# EAGLE schematic led_matrix_v_1_0 (EAGLE 7.3.0)
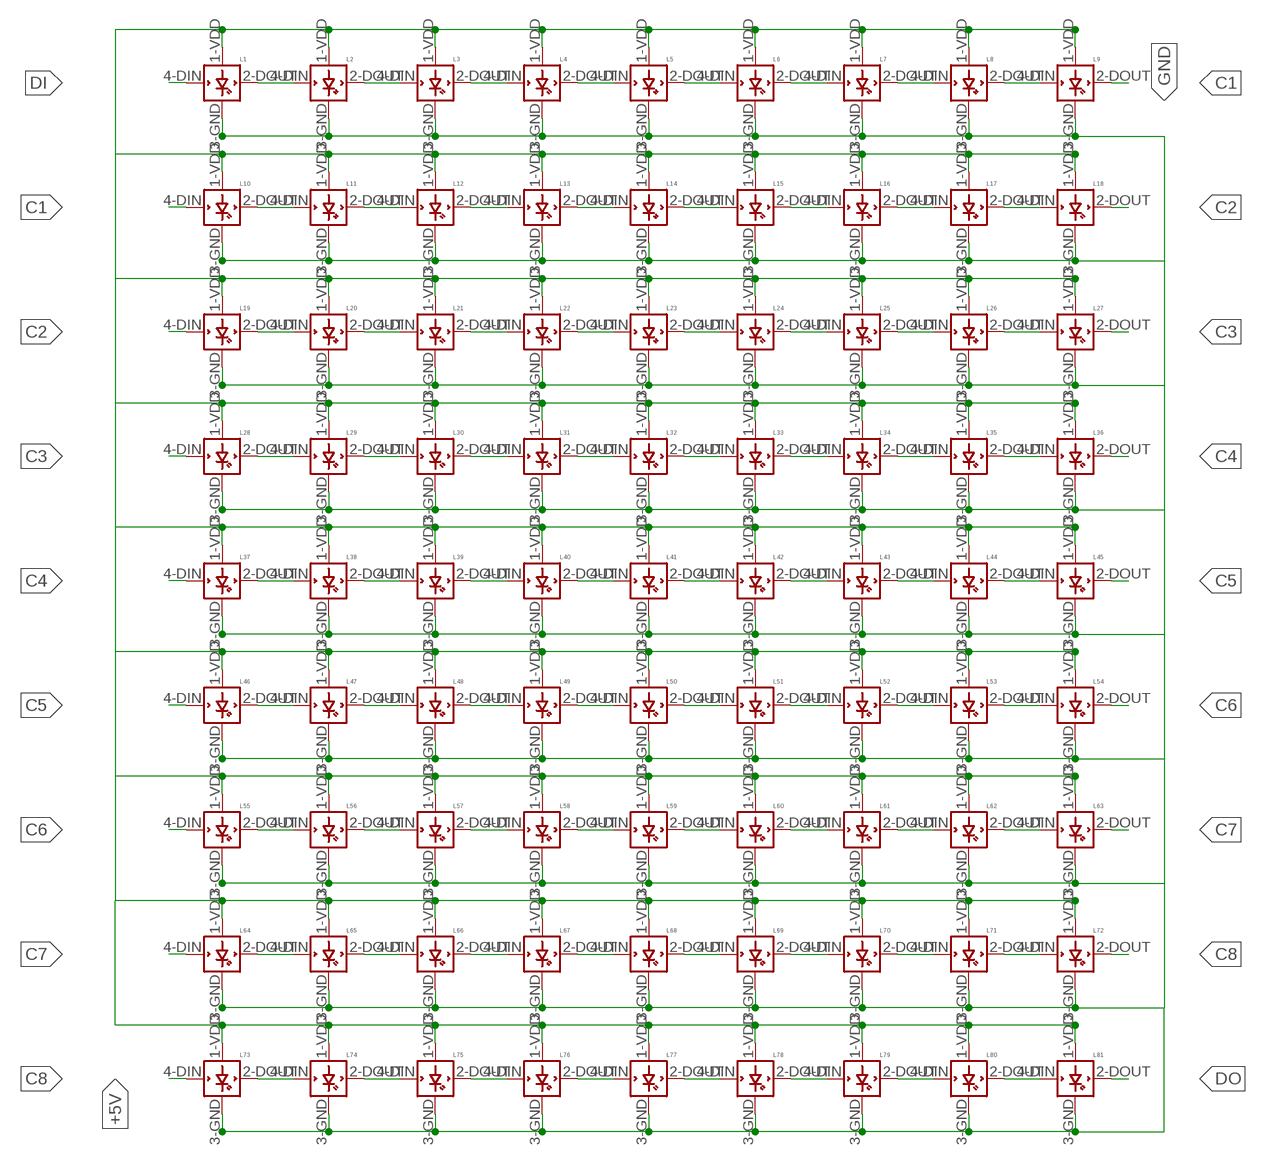
[diagram p0: schematic, sheet 1]

## Parts
L1  WS2812B  [WS2812B]
L2  WS2812B  [WS2812B]
L3  WS2812B  [WS2812B]
L4  WS2812B  [WS2812B]
L5  WS2812B  [WS2812B]
L6  WS2812B  [WS2812B]
L7  WS2812B  [WS2812B]
L8  WS2812B  [WS2812B]
L9  WS2812B  [WS2812B]
L10  WS2812B  [WS2812B]
L11  WS2812B  [WS2812B]
L12  WS2812B  [WS2812B]
L13  WS2812B  [WS2812B]
L14  WS2812B  [WS2812B]
L15  WS2812B  [WS2812B]
L16  WS2812B  [WS2812B]
L17  WS2812B  [WS2812B]
L18  WS2812B  [WS2812B]
L19  WS2812B  [WS2812B]
L20  WS2812B  [WS2812B]
L21  WS2812B  [WS2812B]
L22  WS2812B  [WS2812B]
L23  WS2812B  [WS2812B]
L24  WS2812B  [WS2812B]
L25  WS2812B  [WS2812B]
L26  WS2812B  [WS2812B]
L27  WS2812B  [WS2812B]
L28  WS2812B  [WS2812B]
L29  WS2812B  [WS2812B]
L30  WS2812B  [WS2812B]
L31  WS2812B  [WS2812B]
L32  WS2812B  [WS2812B]
L33  WS2812B  [WS2812B]
L34  WS2812B  [WS2812B]
L35  WS2812B  [WS2812B]
L36  WS2812B  [WS2812B]
L37  WS2812B  [WS2812B]
L38  WS2812B  [WS2812B]
L39  WS2812B  [WS2812B]
L40  WS2812B  [WS2812B]
L41  WS2812B  [WS2812B]
L42  WS2812B  [WS2812B]
L43  WS2812B  [WS2812B]
L44  WS2812B  [WS2812B]
L45  WS2812B  [WS2812B]
L46  WS2812B  [WS2812B]
L47  WS2812B  [WS2812B]
L48  WS2812B  [WS2812B]
L49  WS2812B  [WS2812B]
L50  WS2812B  [WS2812B]
L51  WS2812B  [WS2812B]
L52  WS2812B  [WS2812B]
L53  WS2812B  [WS2812B]
L54  WS2812B  [WS2812B]
L55  WS2812B  [WS2812B]
L56  WS2812B  [WS2812B]
L57  WS2812B  [WS2812B]
L58  WS2812B  [WS2812B]
L59  WS2812B  [WS2812B]
L60  WS2812B  [WS2812B]
L61  WS2812B  [WS2812B]
L62  WS2812B  [WS2812B]
L63  WS2812B  [WS2812B]
L64  WS2812B  [WS2812B]
L65  WS2812B  [WS2812B]
L66  WS2812B  [WS2812B]
L67  WS2812B  [WS2812B]
L68  WS2812B  [WS2812B]
L69  WS2812B  [WS2812B]
L70  WS2812B  [WS2812B]
L71  WS2812B  [WS2812B]
L72  WS2812B  [WS2812B]
L73  WS2812B  [WS2812B]
L74  WS2812B  [WS2812B]
L75  WS2812B  [WS2812B]
L76  WS2812B  [WS2812B]
L77  WS2812B  [WS2812B]
L78  WS2812B  [WS2812B]
L79  WS2812B  [WS2812B]
L80  WS2812B  [WS2812B]
L81  WS2812B  [WS2812B]

## Nets
+5V: L1.1-VDD(VDD) L2.1-VDD(VDD) L3.1-VDD(VDD) L4.1-VDD(VDD) L5.1-VDD(VDD) L6.1-VDD(VDD) L7.1-VDD(VDD) L8.1-VDD(VDD) L9.1-VDD(VDD) L10.1-VDD(VDD) L11.1-VDD(VDD) L12.1-VDD(VDD) L13.1-VDD(VDD) L14.1-VDD(VDD) L15.1-VDD(VDD) L16.1-VDD(VDD) L17.1-VDD(VDD) L18.1-VDD(VDD) L19.1-VDD(VDD) L20.1-VDD(VDD) L21.1-VDD(VDD) L22.1-VDD(VDD) L23.1-VDD(VDD) L24.1-VDD(VDD) L25.1-VDD(VDD) L26.1-VDD(VDD) L27.1-VDD(VDD) L28.1-VDD(VDD) L29.1-VDD(VDD) L30.1-VDD(VDD) L31.1-VDD(VDD) L32.1-VDD(VDD) L33.1-VDD(VDD) L34.1-VDD(VDD) L35.1-VDD(VDD) L36.1-VDD(VDD) L37.1-VDD(VDD) L38.1-VDD(VDD) L39.1-VDD(VDD) L40.1-VDD(VDD) L41.1-VDD(VDD) L42.1-VDD(VDD) L43.1-VDD(VDD) L44.1-VDD(VDD) L45.1-VDD(VDD) L46.1-VDD(VDD) L47.1-VDD(VDD) L48.1-VDD(VDD) L49.1-VDD(VDD) L50.1-VDD(VDD) L51.1-VDD(VDD) L52.1-VDD(VDD) L53.1-VDD(VDD) L54.1-VDD(VDD) L55.1-VDD(VDD) L56.1-VDD(VDD) L57.1-VDD(VDD) L58.1-VDD(VDD) L59.1-VDD(VDD) L60.1-VDD(VDD) L61.1-VDD(VDD) L62.1-VDD(VDD) L63.1-VDD(VDD) L64.1-VDD(VDD) L65.1-VDD(VDD) L66.1-VDD(VDD) L67.1-VDD(VDD) L68.1-VDD(VDD) L69.1-VDD(VDD) L70.1-VDD(VDD) L71.1-VDD(VDD) L72.1-VDD(VDD) L73.1-VDD(VDD) L74.1-VDD(VDD) L75.1-VDD(VDD) L76.1-VDD(VDD) L77.1-VDD(VDD) L78.1-VDD(VDD) L79.1-VDD(VDD) L80.1-VDD(VDD) L81.1-VDD(VDD)
C1: L9.2-DOUT(DOUT) L10.4-DIN(DIN)
C2: L18.2-DOUT(DOUT) L19.4-DIN(DIN)
C3: L27.2-DOUT(DOUT) L28.4-DIN(DIN)
C4: L36.2-DOUT(DOUT) L37.4-DIN(DIN)
C5: L45.2-DOUT(DOUT) L46.4-DIN(DIN)
C6: L54.2-DOUT(DOUT) L55.4-DIN(DIN)
C7: L63.2-DOUT(DOUT) L64.4-DIN(DIN)
C8: L72.2-DOUT(DOUT) L73.4-DIN(DIN)
DI: L1.4-DIN(DIN)
DO: L81.2-DOUT(DOUT)
GND: L1.3-GND(GND) L2.3-GND(GND) L3.3-GND(GND) L4.3-GND(GND) L5.3-GND(GND) L6.3-GND(GND) L7.3-GND(GND) L8.3-GND(GND) L9.3-GND(GND) L10.3-GND(GND) L11.3-GND(GND) L12.3-GND(GND) L13.3-GND(GND) L14.3-GND(GND) L15.3-GND(GND) L16.3-GND(GND) L17.3-GND(GND) L18.3-GND(GND) L19.3-GND(GND) L20.3-GND(GND) L21.3-GND(GND) L22.3-GND(GND) L23.3-GND(GND) L24.3-GND(GND) L25.3-GND(GND) L26.3-GND(GND) L27.3-GND(GND) L28.3-GND(GND) L29.3-GND(GND) L30.3-GND(GND) L31.3-GND(GND) L32.3-GND(GND) L33.3-GND(GND) L34.3-GND(GND) L35.3-GND(GND) L36.3-GND(GND) L37.3-GND(GND) L38.3-GND(GND) L39.3-GND(GND) L40.3-GND(GND) L41.3-GND(GND) L42.3-GND(GND) L43.3-GND(GND) L44.3-GND(GND) L45.3-GND(GND) L46.3-GND(GND) L47.3-GND(GND) L48.3-GND(GND) L49.3-GND(GND) L50.3-GND(GND) L51.3-GND(GND) L52.3-GND(GND) L53.3-GND(GND) L54.3-GND(GND) L55.3-GND(GND) L56.3-GND(GND) L57.3-GND(GND) L58.3-GND(GND) L59.3-GND(GND) L60.3-GND(GND) L61.3-GND(GND) L62.3-GND(GND) L63.3-GND(GND) L64.3-GND(GND) L65.3-GND(GND) L66.3-GND(GND) L67.3-GND(GND) L68.3-GND(GND) L69.3-GND(GND) L70.3-GND(GND) L71.3-GND(GND) L72.3-GND(GND) L73.3-GND(GND) L74.3-GND(GND) L75.3-GND(GND) L76.3-GND(GND) L77.3-GND(GND) L78.3-GND(GND) L79.3-GND(GND) L80.3-GND(GND) L81.3-GND(GND)
N$1: L10.2-DOUT(DOUT) L11.4-DIN(DIN)
N$2: L2.2-DOUT(DOUT) L3.4-DIN(DIN)
N$3: L3.2-DOUT(DOUT) L4.4-DIN(DIN)
N$4: L11.2-DOUT(DOUT) L12.4-DIN(DIN)
N$5: L4.2-DOUT(DOUT) L5.4-DIN(DIN)
N$6: L12.2-DOUT(DOUT) L13.4-DIN(DIN)
N$7: L1.2-DOUT(DOUT) L2.4-DIN(DIN)
N$8: L5.2-DOUT(DOUT) L6.4-DIN(DIN)
N$9: L6.2-DOUT(DOUT) L7.4-DIN(DIN)
N$10: L7.2-DOUT(DOUT) L8.4-DIN(DIN)
N$11: L8.2-DOUT(DOUT) L9.4-DIN(DIN)
N$12: L13.2-DOUT(DOUT) L14.4-DIN(DIN)
N$13: L14.2-DOUT(DOUT) L15.4-DIN(DIN)
N$14: L15.2-DOUT(DOUT) L16.4-DIN(DIN)
N$15: L16.2-DOUT(DOUT) L17.4-DIN(DIN)
N$16: L17.2-DOUT(DOUT) L18.4-DIN(DIN)
N$17: L19.2-DOUT(DOUT) L20.4-DIN(DIN)
N$18: L20.2-DOUT(DOUT) L21.4-DIN(DIN)
N$19: L21.2-DOUT(DOUT) L22.4-DIN(DIN)
N$20: L22.2-DOUT(DOUT) L23.4-DIN(DIN)
N$21: L23.2-DOUT(DOUT) L24.4-DIN(DIN)
N$22: L24.2-DOUT(DOUT) L25.4-DIN(DIN)
N$23: L25.2-DOUT(DOUT) L26.4-DIN(DIN)
N$24: L26.2-DOUT(DOUT) L27.4-DIN(DIN)
N$25: L28.2-DOUT(DOUT) L29.4-DIN(DIN)
N$26: L29.2-DOUT(DOUT) L30.4-DIN(DIN)
N$27: L30.2-DOUT(DOUT) L31.4-DIN(DIN)
N$28: L31.2-DOUT(DOUT) L32.4-DIN(DIN)
N$29: L32.2-DOUT(DOUT) L33.4-DIN(DIN)
N$30: L33.2-DOUT(DOUT) L34.4-DIN(DIN)
N$31: L34.2-DOUT(DOUT) L35.4-DIN(DIN)
N$32: L35.2-DOUT(DOUT) L36.4-DIN(DIN)
N$33: L37.2-DOUT(DOUT) L38.4-DIN(DIN)
N$34: L38.2-DOUT(DOUT) L39.4-DIN(DIN)
N$35: L39.2-DOUT(DOUT) L40.4-DIN(DIN)
N$36: L40.2-DOUT(DOUT) L41.4-DIN(DIN)
N$37: L41.2-DOUT(DOUT) L42.4-DIN(DIN)
N$38: L42.2-DOUT(DOUT) L43.4-DIN(DIN)
N$39: L43.2-DOUT(DOUT) L44.4-DIN(DIN)
N$40: L44.2-DOUT(DOUT) L45.4-DIN(DIN)
N$41: L46.2-DOUT(DOUT) L47.4-DIN(DIN)
N$42: L47.2-DOUT(DOUT) L48.4-DIN(DIN)
N$43: L48.2-DOUT(DOUT) L49.4-DIN(DIN)
N$44: L49.2-DOUT(DOUT) L50.4-DIN(DIN)
N$45: L50.2-DOUT(DOUT) L51.4-DIN(DIN)
N$46: L51.2-DOUT(DOUT) L52.4-DIN(DIN)
N$47: L52.2-DOUT(DOUT) L53.4-DIN(DIN)
N$48: L53.2-DOUT(DOUT) L54.4-DIN(DIN)
N$49: L55.2-DOUT(DOUT) L56.4-DIN(DIN)
N$50: L56.2-DOUT(DOUT) L57.4-DIN(DIN)
N$51: L57.2-DOUT(DOUT) L58.4-DIN(DIN)
N$52: L58.2-DOUT(DOUT) L59.4-DIN(DIN)
N$53: L59.2-DOUT(DOUT) L60.4-DIN(DIN)
N$54: L60.2-DOUT(DOUT) L61.4-DIN(DIN)
N$55: L61.2-DOUT(DOUT) L62.4-DIN(DIN)
N$56: L62.2-DOUT(DOUT) L63.4-DIN(DIN)
N$57: L64.2-DOUT(DOUT) L65.4-DIN(DIN)
N$58: L65.2-DOUT(DOUT) L66.4-DIN(DIN)
N$59: L66.2-DOUT(DOUT) L67.4-DIN(DIN)
N$60: L67.2-DOUT(DOUT) L68.4-DIN(DIN)
N$61: L68.2-DOUT(DOUT) L69.4-DIN(DIN)
N$62: L69.2-DOUT(DOUT) L70.4-DIN(DIN)
N$63: L70.2-DOUT(DOUT) L71.4-DIN(DIN)
N$64: L71.2-DOUT(DOUT) L72.4-DIN(DIN)
N$65: L73.2-DOUT(DOUT) L74.4-DIN(DIN)
N$66: L74.2-DOUT(DOUT) L75.4-DIN(DIN)
N$67: L75.2-DOUT(DOUT) L76.4-DIN(DIN)
N$68: L76.2-DOUT(DOUT) L77.4-DIN(DIN)
N$69: L77.2-DOUT(DOUT) L78.4-DIN(DIN)
N$70: L78.2-DOUT(DOUT) L79.4-DIN(DIN)
N$71: L79.2-DOUT(DOUT) L80.4-DIN(DIN)
N$72: L80.2-DOUT(DOUT) L81.4-DIN(DIN)

## Library data of the parts
L1-L81 = adafruit:WS2812B